# Altium schematic sheet 示波器原理图.SchDoc
size A4
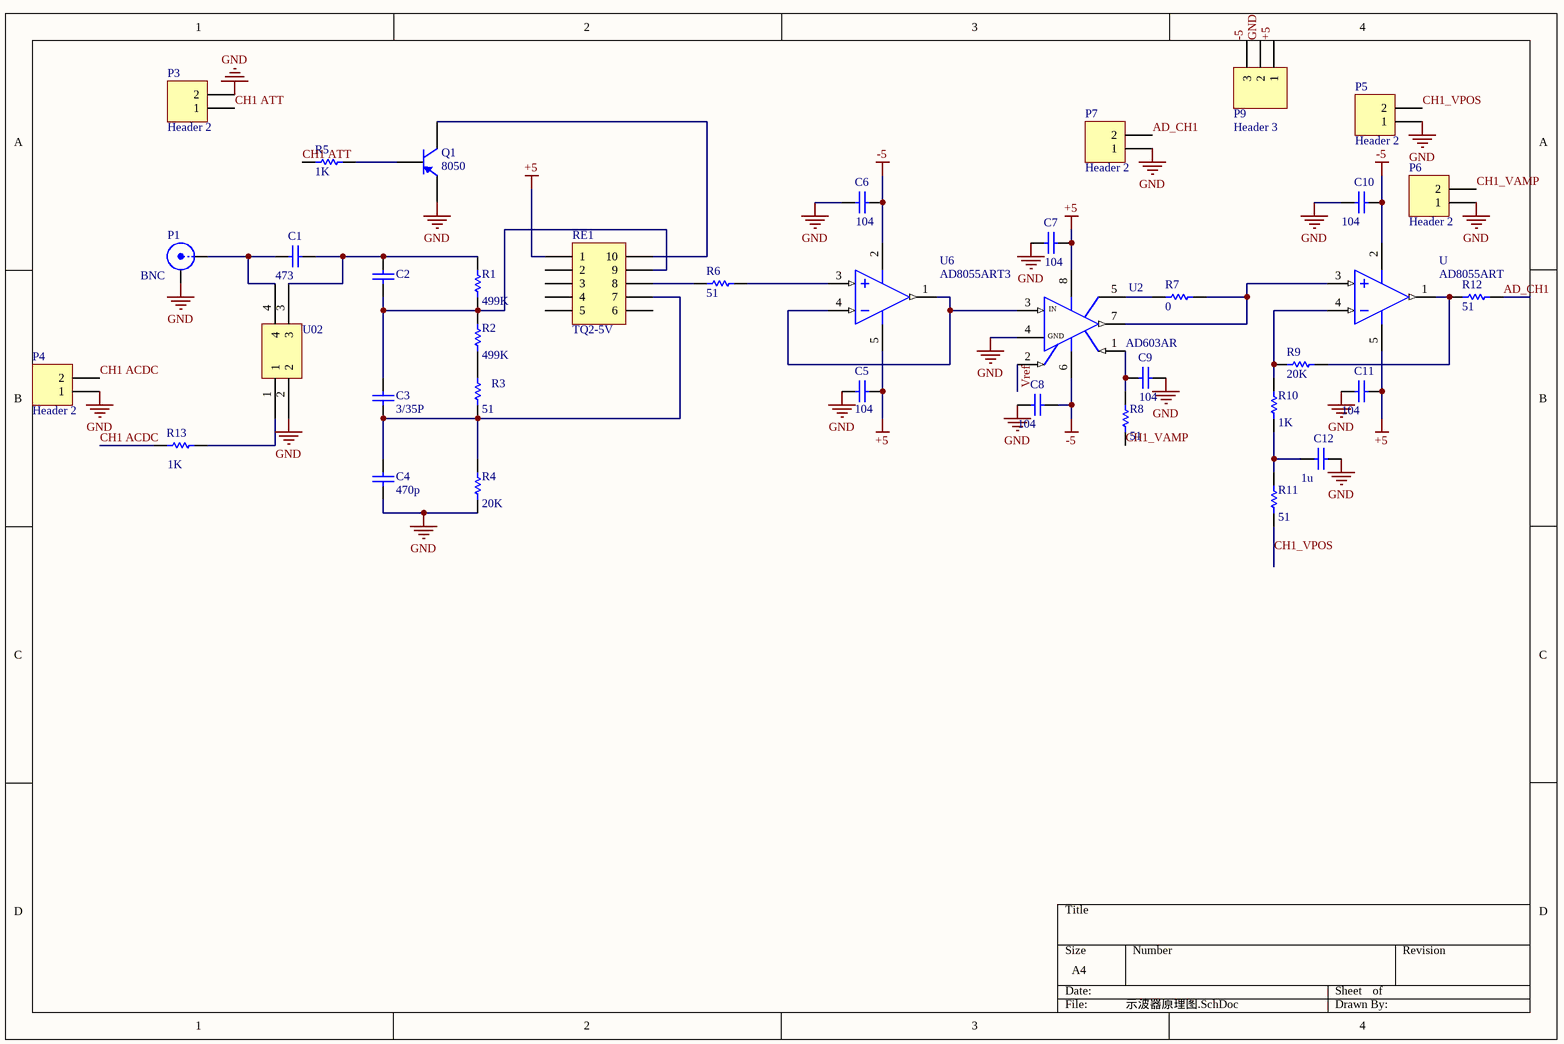
[diagram p0: 示波器原理图.SchDoc]

## Parts
C1  value 473  [PCBComponent_1]
C2  (no value)  [PCBComponent_1]
C3  value 3/35P  [PCBComponent_1]
C4  value 470p  [PCBComponent_1]
C5  value 104  [PCBComponent_1]
C6  104  [PCBComponent_1]
C7  value 104  [PCBComponent_1]
C8  value 104  [PCBComponent_1]
C9  value 104  [PCBComponent_1]
C10  value 104  [PCBComponent_1]
C11  value 104  [PCBComponent_1]
C12  value 1u  [PCBComponent_1]
P1  BNC  [BNC_RA CON]
P3  Header 2  [HDR1X2]
P4  Header 2  [HDR1X2]
P5  Header 2  [HDR1X2]
P6  Header 2  [HDR1X2]
P7  Header 2  [HDR1X2]
P9  Header 3  [HDR1X3]
Q1  8050  [PCBComponent_1]
R1  value 499K  [PCBComponent_1]
R2  value 499K  [PCBComponent_1]
R3  value 51  [PCBComponent_1]
R4  value 20K  [2012[0805]]
R5  value 1K  [PCBComponent_1]
R6  value 51  [PCBComponent_1]
R7  value 0  [2012[0805]]
R8  value 51  [2012[0805]]
R9  value 20K  [2012[0805]]
R10  value 1K  [2012[0805]]
R11  value 51  [2012[0805]]
R12  value 51  [2012[0805]]
R13  value 1K  [PCBComponent_1]
RE1  TQ2-5V  [PCBComponent_1]
U  AD8055ART  [SOT95P245X110-5N]
U2  AD603AR  [SOIC127P600X175-8N]
U02  (no value)  [SOP254P610X218-4N]
U6  AD8055ART3  [SOT95P245X110-5N]

## Nets
+5: C5.1 C7.2 C11.2 P9.1 RE1.1 U.5(V+) U2.8(V+) U6.5(V+)
-5: C6.1 C8.2 C10.2 P9.3 U.2(V-) U2.6(V-) U6.2(V-)
GND: C4.1 C5.2 C6.2 C7.1 C8.1 C9.2 C10.1 C11.1 C12.2 P1.2(Y) P3.2 P4.1 P5.1 P6.1 P7.1 P9.2 Q1.1(E) R4.1 U02.2 U2.4(COMM)
AD_CH1: P7.2 R12.1
CH1 ACDC: P4.2 R13.1
CH1 ATT: P3.1 R5.2
CH1_VAMP: P6.2 R8.1
CH1_VPOS: P5.2 R11.1
Vref: U2.2(G-)
NetC1_1: C1.1 P1.1(X) U02.4
NetC1_2: C1.2 C2.2 R1.2 U02.3
NetC2_1: C2.1 C3.2 R1.1 R2.2 RE1.9
NetC3_1: C3.1 C4.2 R3.1 R4.2 RE1.7
NetC9_1: C9.1 R8.2 U2.1(G+)
NetC12_1: C12.1 R10.1 R11.2
NetQ1_2: Q1.2(B) R5.1
NetQ1_3: Q1.3(C) RE1.10
NetR2_1: R2.1 R3.2
NetR6_1: R6.1 U6.3(IN+)
NetR6_2: R6.2 RE1.8
NetR7_1: R7.1 U.3(IN+) U2.7(VOUT)
NetR7_2: R7.2 U2.5(FDBK)
NetR9_1: R9.1 R12.2 U.1(OUT)
NetR9_2: R9.2 R10.2 U.4(IN-)
NetR13_2: R13.2 U02.1
NetU2_3: U2.3(VINP) U6.1(OUT) U6.4(IN-)

Not connected (* = marked no-connect by the designer): RE1 2 3 4 5 6

## Notes on the sheet
- (in symbol AD603AR) IN; GND

## Library data of the parts
C1-C12 = Cap: Capacitor; Published: 8-Jun-2000; LatestRevisionDate: 17-Jul-2002; LatestRevisionNote: Re-released for DXP Platform.; PackageReference: RAD-0.3; Publisher: Altium Limited
P1 = BNC: BNC Elbow Connector; LatestRevisionDate: 17-Jul-2002; LatestRevisionNote: Re-released for DXP Platform.; Publisher: Altium Limited
P3-P7 = Header 2: Header, 2-Pin; LatestRevisionDate: 17-Jul-2002; LatestRevisionNote: Re-released for DXP Platform.; Publisher: Altium Limited
P9 = Header 3: Header, 3-Pin; LatestRevisionDate: 17-Jul-2002; LatestRevisionNote: Re-released for DXP Platform.; Publisher: Altium Limited
Q1 = 2N3906: PNP General Purpose Amplifier; Published: 8-Jun-2000; LatestRevisionDate: 15-Jan-2003; LatestRevisionNote: PCB Footprint 'BCY-W3/D4.7' replaced; DatasheetDocument: 1997; PackageDocument: Sep-1998; PackageReference: TO-92A; Publisher: Altium Limited; Code_JEDEC: TO-92A; ComponentLink1Description: Manufacturer Link; ComponentLink1URL: http://www.fairchildsemi.com/; ComponentLink2Description: Datasheet; ComponentLink2URL: http://www.fairchildsemi.com/ds/2N%2F2N3906.pdf
R1-R3 R5 R6 R13 = Res1: Resistor; Published: 8-Jun-2000; LatestRevisionDate: 17-Jul-2002; LatestRevisionNote: Re-released for DXP Platform.; PackageReference: AXIAL-0.3; Publisher: Altium Limited
R4 R7-R12 = Res Semi: Semiconductor Resistor; Published: 8-Jun-2000; LatestRevisionDate: 17-Jul-2002; LatestRevisionNote: Re-released for DXP Platform.; PackageReference: AXIAL-0.5; Publisher: Altium Limited
RE1 U02 = Component_1
U U6 = AD8055ART: Low Cost, 300MHz Voltage Feedback Amplifier; Text Field7: Published 8-Jun-2000
U2 = AD603AR: Low-Noise, 90MHz Variable Gain Amplifier; Text Field7: Published 8-Jun-2000, Modified 10-July-2000: SIM Model Added.